# Altium schematic sheet Power Supply.SchDoc: Power Supply
size A3; DocumentNumber: 2; SheetNumber: 2; SheetTotal: 6
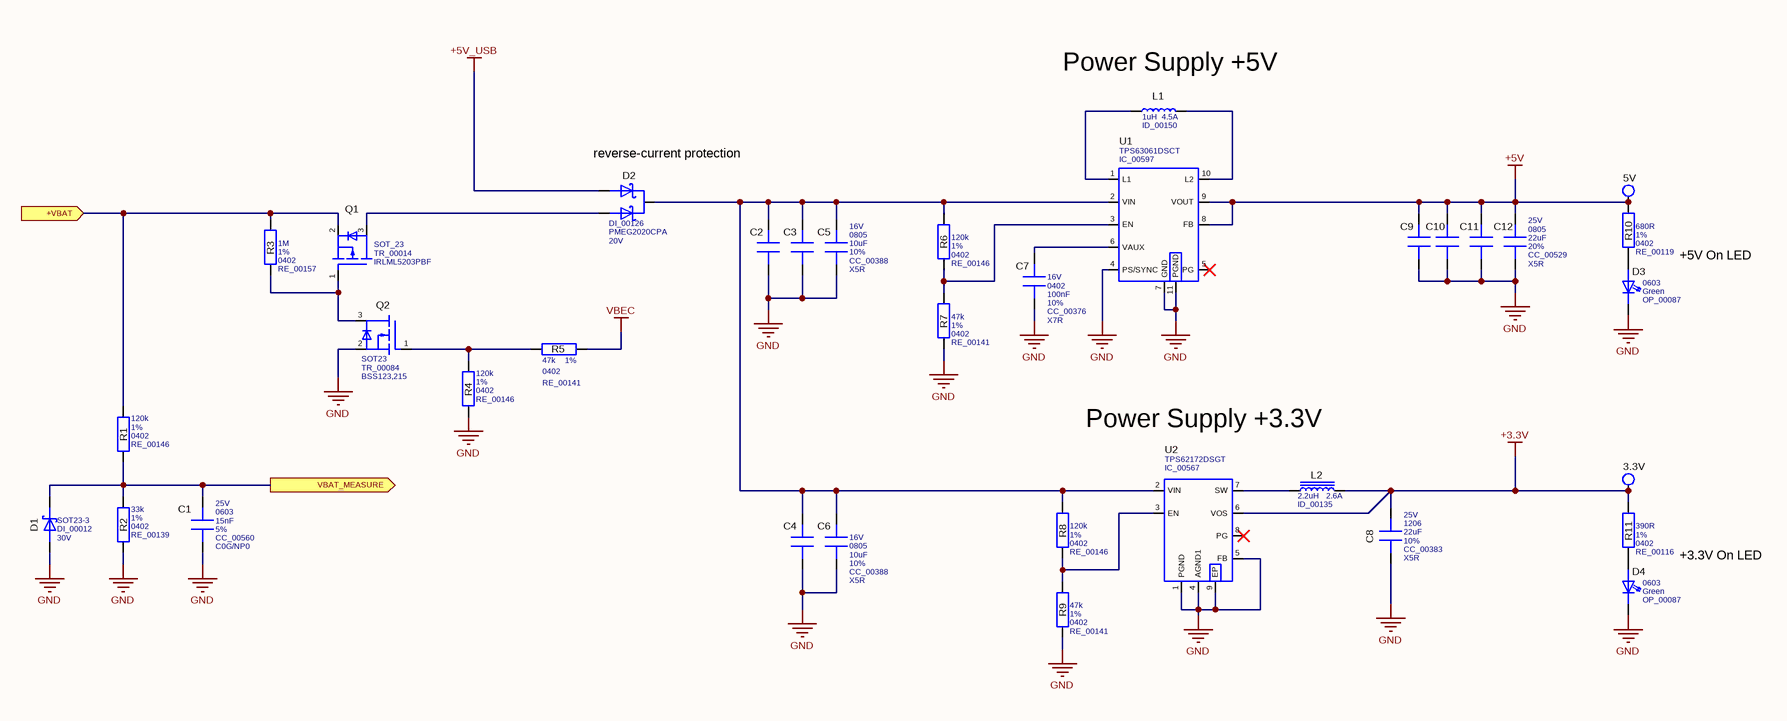
[diagram p0: Power Supply.SchDoc]

## Parts
3.3V  testpoint  [CO_00057N]  (value not drawn)  (no BOM)
5V  testpoint  [CO_00057N]  (value not drawn)  (no BOM)
C1  Voltage: 25V  Package: 0603  Capacitance: 15nF  Tolerance: 5%  Part_Number: CC_00560  Dielectric_Material: C0G/NP0  [CS1600X800X900X350X1250L]  (hidden comment: capacitor)
C2  capacitor  [CS2000x1250x1250x350x1650L]  (value not drawn)
C3  capacitor  [CS2000x1250x1250x350x1650L]  (value not drawn)
C4  capacitor  [CS2000x1250x1250x350x1650L]  (value not drawn)
C5  Voltage: 16V  Package: 0805  Capacitance: 10uF  Tolerance: 10%  Part_Number: CC_00388  Dielectric_Material: X5R  [CS2000x1250x1250x350x1650L]  (hidden comment: capacitor)
C6  Voltage: 16V  Package: 0805  Capacitance: 10uF  Tolerance: 10%  Part_Number: CC_00388  Dielectric_Material: X5R  [CS2000x1250x1250x350x1650L]  (hidden comment: capacitor)
C7  Voltage: 16V  Package: 0402  Capacitance: 100nF  Tolerance: 10%  Part_Number: CC_00376  Dielectric_Material: X7R  [CS1000X500X560X250X820L]  (hidden comment: capacitor)
C8  Voltage: 25V  Package: 1206  Capacitance: 22uF  Tolerance: 10%  Part_Number: CC_00383  Dielectric_Material: X5R  [CS3200x1600x900x500x2700L]  (hidden comment: capacitor)
C9  capacitor  [CS2000x1250x1250x350x1650L]  (value not drawn)
C10  capacitor  [CS2000x1250x1250x350x1650L]  (value not drawn)
C11  capacitor  [CS2000x1250x1250x350x1650L]  (value not drawn)
C12  Voltage: 25V  Package: 0805  Capacitance: 22uF  Tolerance: 20%  Part_Number: CC_00529  Dielectric_Material: X5R  [CS2000x1250x1250x350x1650L]  (hidden comment: capacitor)
D1  Package: SOT23-3  Reverse_Voltage: 30V  [DI_00012N]  (hidden comment: DI_00012)
D2  Manufacturer_Number: PMEG2020CPA  Reverse_Voltage: 20V  [DI_00126N]  (hidden comment: DI_00126)
D3  Package: 0603  Color: Green  Part_Number: OP_00087  [OP_00087L]  (hidden comment: LED)
D4  Package: 0603  Color: Green  Part_Number: OP_00087  [OP_00087L]  (hidden comment: LED)
L1  Inductance: 1uH  Part_Number: ID_00150  Current_DC: 4.5A  [ID_00150N]  (hidden comment: inductor)
L2  Inductance: 2.2uH  Part_Number: ID_00135  Current_DC: 2.6A  [ID_00135N]  (hidden comment: inductor_shielded)
Q1  Package: SOT_23  Part_Number: TR_00014  Manufacturer_Number: IRLML5203PBF  [TR_00014N]  (hidden comment: pmosfet)
Q2  Package: SOT23  Part_Number: TR_00084  Manufacturer_Number: BSS123,215  [TR_00084N]  (hidden comment: nmosfet)
R1  Resistance: 120k  Tolerance: 1%  Package: 0402  Part_Number: RE_00146  [RS1000X500X560X250X820L]  (hidden comment: Resistor)
R2  Resistance: 33k  Tolerance: 1%  Package: 0402  Part_Number: RE_00139  [RS1000X500X560X250X820L]  (hidden comment: Resistor)
R3  Resistance: 1M  Tolerance: 1%  Package: 0402  Part_Number: RE_00157  [RS1000X500X560X250X820L]  (hidden comment: Resistor)
R4  Resistance: 120k  Tolerance: 1%  Package: 0402  Part_Number: RE_00146  [RS1000X500X560X250X820L]  (hidden comment: Resistor)
R5  Resistance: 47k  Tolerance: 1%  Package: 0402  Part_Number: RE_00141  [RS1000X500X560X250X820L]  (hidden comment: Resistor)
R6  Resistance: 120k  Tolerance: 1%  Package: 0402  Part_Number: RE_00146  [RS1000X500X560X250X820L]  (hidden comment: Resistor)
R7  Resistance: 47k  Tolerance: 1%  Package: 0402  Part_Number: RE_00141  [RS1000X500X560X250X820L]  (hidden comment: Resistor)
R8  Resistance: 120k  Tolerance: 1%  Package: 0402  Part_Number: RE_00146  [RS1000X500X560X250X820L]  (hidden comment: Resistor)
R9  Resistance: 47k  Tolerance: 1%  Package: 0402  Part_Number: RE_00141  [RS1000X500X560X250X820L]  (hidden comment: Resistor)
R10  Resistance: 680R  Tolerance: 1%  Package: 0402  Part_Number: RE_00119  [RS1000X500X560X250X820L]  (hidden comment: Resistor)
R11  Resistance: 390R  Tolerance: 1%  Package: 0402  Part_Number: RE_00116  [RS1000X500X560X250X820L]  (hidden comment: Resistor)
U1  Manufacturer_Number: TPS63061DSCT  [IC_00597N]  (hidden comment: IC_00597)
U2  Manufacturer_Number: TPS62172DSGT  [IC_00567N]  (hidden comment: IC_00567)

## Ports
+VBAT (in), VBAT_MEASURE (out)

## Nets
+3.3V: 3.3V.1(PIN1) C8.2(PIN2) L2.2(PIN2) R11.2(PIN2) U2.6(VOS)
+5V: 5V.1(PIN1) C9.2(PIN2) C10.2(PIN2) C11.2(PIN2) C12.2(PIN2) R10.2(PIN2) U1.8(FB) U1.9(VOUT)
+5V_USB: D2.2(A1)
GND: C1.1(PIN1) C2.1(PIN1) C3.1(PIN1) C4.1(PIN1) C5.1(PIN1) C6.1(PIN1) C7.1(PIN1) C8.1(PIN1) C9.1(PIN1) C10.1(PIN1) C11.1(PIN1) C12.1(PIN1) D1.1(ANODE) D3.1(CATHODE) D4.1(CATHODE) Q2.2(S) R2.1(PIN1) R4.1(PIN1) R7.2(PIN2) R9.2(PIN2) U1.4(PS/SYNC) U1.7(GND) U1.11(PGND) U2.1(PGND) U2.4(AGND1) U2.5(FB) U2.9(EP)
VBEC: R5.2(PIN2)
+VBAT: Q1.2(S) R1.2(PIN2) R3.2(PIN2) ; port +VBAT
VBAT_MEASURE: C1.2(PIN2) D1.3(CATHODE) R1.1(PIN1) R2.2(PIN2) ; port VBAT_MEASURE
NetC2_2: C2.2(PIN2) C3.2(PIN2) C4.2(PIN2) C5.2(PIN2) C6.2(PIN2) D2.3(C) R6.2(PIN2) R8.2(PIN2) U1.2(VIN) U2.2(VIN)
NetC7_2: C7.2(PIN2) U1.6(VAUX)
NetD2_1: D2.1(A) Q1.3(D)
NetD3_2: D3.2(ANODE) R10.1(PIN1)
NetD4_2: D4.2(ANODE) R11.1(PIN1)
NetL1_1: L1.1(PIN1) U1.1(L1)
NetL1_2: L1.2(PIN2) U1.10(L2)
NetL2_1: L2.1(PIN1) U2.7(SW)
NetQ1_1: Q1.1(G) Q2.3(D) R3.1(PIN1)
NetQ2_1: Q2.1(G) R4.2(PIN2) R5.1(PIN1)
NetR6_1: R6.1(PIN1) R7.1(PIN1) U1.3(EN)
NetR8_1: R8.1(PIN1) R9.1(PIN1) U2.3(EN)

Not connected (* = marked no-connect by the designer): U1 5(PG)*; U2 8(PG)*

## Notes on the sheet
- (near L1) Power Supply +5V
- (near D2) reverse-current protection
- +5V On LED
- Power Supply +3.3V
- +3.3V On LED
- Size
- A3
- Rev
- Sheet
- of
- Date changed
- FH  JOANNEUM
- University of Applied Sciences
- Drawn by
- Title
- Check by

## Library data of the parts
3.3V 5V = CO_00057: Testpoint 1.6mm Bohrung 1mm; Current: 0A; Impedance: 0R; Nominal_AC_Voltage: 0VAC; Nominal_DC_Voltage: 0VDC; Power: 0W; Part_Number: CO_00057; Manufacturer_Number: Testpoint; Connector_Type: Testpoint; Creator: Sirnik Heimo; Creation_Date: 09.07.2012; Datasheet_Link: http://ibi/dxdb_partdatasheet_download.php?pid=485
C1 = CC_00560: Part_Type: Fixed capacitors; Manufacturer_Number: C0603C153J3GACTU; Maximum_Capacitance: 0; Creator: Krenn Markus; Minimum_Capacitance: 0; Nominal_Voltage: 0; Creation_Date: 13.06.2016; Datasheet_Link: http://ibi/dxdb_partdatasheet_download.php?pid=3182
C2-C4 = CC_00388: Part_Type: Fixed capacitors; Manufacturer_Number: GRM21BR61C106KE15L; Voltage: 16V; Capacitance: 10uF; Tolerance: 10%; Dielectric_Material: X5R; Maximum_Capacitance: 0; Package: 0805; Creator: Krenn Markus; Part_Number: CC_00388; Minimum_Capacitance: 0; Nominal_Voltage: 0; Creation_Date: 09.07.2012; Datasheet_Link: http://ibi/dxdb_partdatasheet_download.php?pid=388
C5 C6 = CC_00388: Part_Type: Fixed capacitors; Manufacturer_Number: GRM21BR61C106KE15L; Maximum_Capacitance: 0; Creator: Krenn Markus; Minimum_Capacitance: 0; Nominal_Voltage: 0; Creation_Date: 09.07.2012; Datasheet_Link: http://ibi/dxdb_partdatasheet_download.php?pid=388
C7 = CC_00376: Part_Type: Fixed capacitors; Manufacturer_Number: GRM155R71C104KA88D; Maximum_Capacitance: 0; Creator: Okorn Robert; Minimum_Capacitance: 0; Nominal_Voltage: 0; Creation_Date: 09.07.2012; Datasheet_Link: http://ibi/dxdb_partdatasheet_download.php?pid=376
C8 = CC_00383: Part_Type: Fixed capacitors; Manufacturer_Number: GRM31CR61E226KE15L; Maximum_Capacitance: 0; Creator: Neissl Gernot; Minimum_Capacitance: 0; Nominal_Voltage: 0; Creation_Date: 09.07.2012; Datasheet_Link: http://ibi/dxdb_partdatasheet_download.php?pid=383
C9-C11 = CC_00529: Part_Type: Fixed capacitors; Manufacturer_Number: GRM21BR61E226ME44L; Voltage: 25V; Capacitance: 22uF; Tolerance: 20%; Dielectric_Material: X5R; Maximum_Capacitance: 0; Package: 0805; Creator: Neissl Gernot; Part_Number: CC_00529; Minimum_Capacitance: 0; Nominal_Voltage: 0; Creation_Date: 05.02.2015; Datasheet_Link: http://ibi/dxdb_partdatasheet_download.php?pid=2855
C12 = CC_00529: Part_Type: Fixed capacitors; Manufacturer_Number: GRM21BR61E226ME44L; Maximum_Capacitance: 0; Creator: Neissl Gernot; Minimum_Capacitance: 0; Nominal_Voltage: 0; Creation_Date: 05.02.2015; Datasheet_Link: http://ibi/dxdb_partdatasheet_download.php?pid=2855
D1 = DI_00012: BAR43 - Schottky Diode, 30V, 100mA; Manufacturer_Number: BAR43FILM; Material: Silicon; Power: 0W; Diodes_per_package: 1; Forward_Voltage: 330mV; Reverse-recovery_time: 5ns; Creator: Krenn Markus; Part_Number: DI_00012; Diode_type: Schottky Diode; Current_DC: 100mA; Creation_Date: 09.07.2012; Datasheet_Link: http://ibi/dxdb_partdatasheet_download.php?pid=777
D2 = DI_00126: 2 A low V F  dual MEGA Schottky barrier rectifier; Material: Silicon; Power: 500mW; Diode_type: Schottky Diode; Current_DC: 2A; Diodes_per_package: 2; Forward_Voltage: 385mV; Reverse-recovery_time: 55ns; Creator: Krenn Markus; Part_Number: DI_00126; Creation_Date: 09.06.2016; Datasheet_Link: http://ibi/dxdb_partdatasheet_download.php?pid=3180
D3 D4 = OP_00087: Manufacturer_Number: TLMG1100-GS08; Type: Standard; Isolating_voltage: 0; Creator: Krenn Markus; Part_Type: LED; Transistor_type: 0; Creation_Date: 23.05.2016; Datasheet_Link: http://ibi/dxdb_partdatasheet_download.php?pid=3140
L1 = ID_00150: Manufacturer_Number: XFL4020-102MEC; Part_Type: Inductors; Creator: Krenn Markus; Creation_Date: 07.06.2016; Datasheet_Link: http://ibi/dxdb_partdatasheet_download.php?pid=3175
L2 = ID_00135: Manufacturer_Number: SDR0403-2R2ML; Part_Type: Inductors; Creator: Krenn Markus; Creation_Date: 01.07.2015; Datasheet_Link: http://ibi/dxdb_partdatasheet_download.php?pid=3002
Q1 = TR_00014: Part_Type: MOSFET; Current: 0; Drain-Source_DC_current: 3A; Drain-Source_Voltage: -30V; Creator: Neissl Gernot; Collector-Emitter_voltage: 0; Reverse_voltage: 0; RMS_Current: 0; Creation_Date: 09.07.2012; Datasheet_Link: http://ibi/dxdb_partdatasheet_download.php?pid=2091
Q2 = TR_00084: Part_Type: MOSFET; Current: 0; Drain-Source_DC_current: 150mA; Drain-Source_Voltage: 100V; Creator: Weis Gerald; Collector-Emitter_voltage: 0; Reverse_voltage: 0; RMS_Current: 0; Creation_Date: 07.04.2016; Datasheet_Link: http://ibi/dxdb_partdatasheet_download.php?pid=3103
R1 R4 R6 R8 = RE_00146: Manufacturer_Number: RC0402FR-07120KL; Part_Type: Fixed Resistors; Maximum_Resistance: 0; Nominal_voltage: 50V; Type: 0; Creator: Krenn Markus; Nominal_DC_Voltage: 0; Impact_current: 0; Creation_Date: 09.07.2012; Datasheet_Link: http://ibi/dxdb_partdatasheet_download.php?pid=1551
R2 = RE_00139: Manufacturer_Number: MC00625W0402133K; Part_Type: Fixed Resistors; Maximum_Resistance: 0; Nominal_voltage: 50V; Type: 0; Creator: Krenn Markus; Nominal_DC_Voltage: 0; Impact_current: 0; Creation_Date: 09.07.2012; Datasheet_Link: http://ibi/dxdb_partdatasheet_download.php?pid=1544
R3 = RE_00157: Manufacturer_Number: MC00625W040211M; Part_Type: Fixed Resistors; Maximum_Resistance: 0; Nominal_voltage: 50V; Type: 0; Creator: Krenn Markus; Nominal_DC_Voltage: 0; Impact_current: 0; Creation_Date: 09.07.2012; Datasheet_Link: http://ibi/dxdb_partdatasheet_download.php?pid=1562
R5 R7 R9 = RE_00141: Manufacturer_Number: MC00625W0402147K; Part_Type: Fixed Resistors; Maximum_Resistance: 0; Nominal_voltage: 50V; Type: 0; Creator: Krenn Markus; Nominal_DC_Voltage: 0; Impact_current: 0; Creation_Date: 09.07.2012; Datasheet_Link: http://ibi/dxdb_partdatasheet_download.php?pid=1546
R10 = RE_00119: Manufacturer_Number: MC00625W04021680R; Part_Type: Fixed Resistors; Maximum_Resistance: 0; Nominal_voltage: 50V; Type: 0; Nominal_DC_Voltage: 0; Impact_current: 0; Creator: Krenn Markus; Creation_Date: 09.07.2012; Datasheet_Link: http://ibi/dxdb_partdatasheet_download.php?pid=1524
R11 = RE_00116: Manufacturer_Number: MC00625W04021390R; Part_Type: Fixed Resistors; Maximum_Resistance: 0; Nominal_voltage: 50V; Type: 0; Creator: Krenn Markus; Nominal_DC_Voltage: 0; Impact_current: 0; Creation_Date: 09.07.2012; Datasheet_Link: http://ibi/dxdb_partdatasheet_download.php?pid=1521
U1 = IC_00597: TPS62172DSGT - Step-Down Converter with DCS-Control; Part_Type: Switching Regulators and Controllers; Creator: Krenn Markus; Part_Number: IC_00597; Creation_Date: 18.05.2016; Datasheet_Link: http://ibi/dxdb_partdatasheet_download.php?pid=3137
U2 = IC_00567: TPS62172DSGT - Step-Down Converter with DCS-Control; Part_Type: Switching Regulators and Controllers; Creator: Krenn Markus; Part_Number: IC_00567; Creation_Date: 30.06.2015; Datasheet_Link: http://ibi/dxdb_partdatasheet_download.php?pid=3001